# EAGLE schematic potentiometer (EAGLE 6.3)
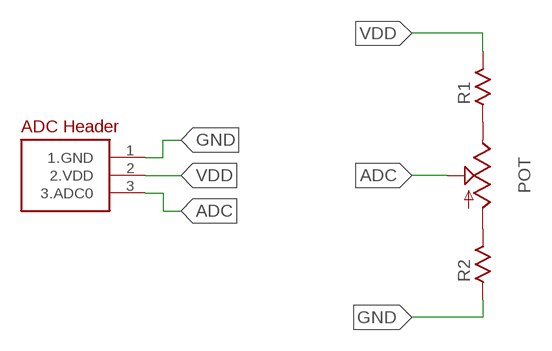
[diagram p0: schematic, sheet 1]

## Parts
POT  TRIM3386  [TRIM-3386]
R1  R0805  [R0805]
R2  R0805  [R0805]
U$1  VIVA-HEADER-ADC-1  [VIVA-HEADER-ADC-RA-2]

## Nets
ADC: POT.2(S) U$1.3(3.ADC0)
GND: R2.1 U$1.1(1.GND)
N$1: POT.1(E) R1.1
N$2: POT.3(A) R2.2
VDD: R1.2 U$1.2(2.VDD)

## Library data of the parts
POT = nolan-utsa:TRIM
R1 R2 = nolan-utsa:R
U$1 = nolan-utsa:VIVA-HEADER-ADC-1